# Altium schematic sheet Sheet1.SchDoc
size A4
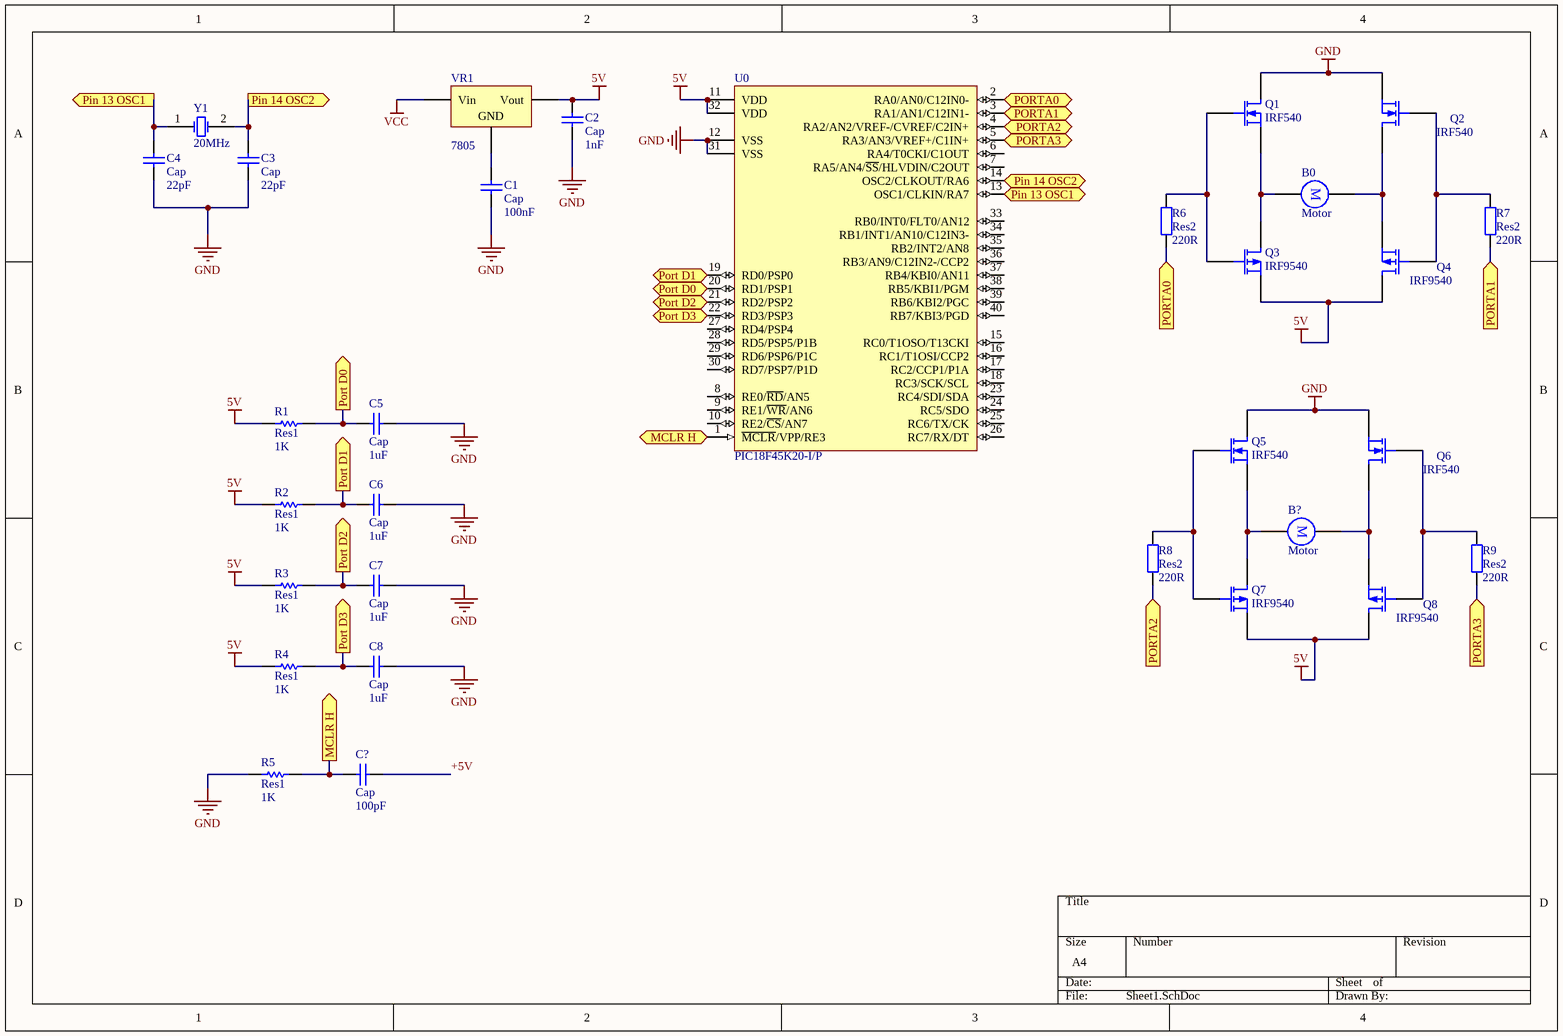
[diagram p0: Sheet1.SchDoc]

## Parts
B0  Motor  [RB5-10.5]
B?  Motor  [RB5-10.5]
C1  Cap  C1: 100nF  [RAD-0.3]
C2  Cap  value 1nF  [RAD-0.3]
C3  Cap  value 22pF  [RAD-0.3]
C4  Cap  value 22pF  [RAD-0.3]
C5  Cap  value 1uF  [RAD-0.3]
C6  Cap  value 1uF  [RAD-0.3]
C7  Cap  value 1uF  [RAD-0.3]
C8  Cap  value 1uF  [RAD-0.3]
C?  Cap  value 100pF  [RAD-0.3]
Q1  IRF540  [BCY-W3/B.8]
Q2  IRF540  [BCY-W3/B.8]
Q3  IRF9540  [BCY-W3/B.8]
Q4  IRF9540  [BCY-W3/B.8]
Q5  IRF540  [BCY-W3/B.8]
Q6  IRF540  [BCY-W3/B.8]
Q7  IRF9540  [BCY-W3/B.8]
Q8  IRF9540  [BCY-W3/B.8]
R1  Res1  value 1K  [AXIAL-0.3]
R2  Res1  value 1K  [AXIAL-0.3]
R3  Res1  value 1K  [AXIAL-0.3]
R4  Res1  value 1K  [AXIAL-0.3]
R5  Res1  value 1K  [AXIAL-0.3]
R6  Res2  value 220R  [AXIAL-0.4]
R7  Res2  value 220R  [AXIAL-0.4]
R8  Res2  value 220R  [AXIAL-0.4]
R9  Res2  value 220R  [AXIAL-0.4]
U0  PIC18F45K20-I/P  [PDIP600-P40]
VR1  7805  [TO254P1510-3_4N]
Y1  20MHz  [BCY-W2/D3.1]

## Ports
MCLR H (out), Pin 13 OSC1 (in), Pin 13 OSC1 (out), Pin 14 OSC2 (in), Pin 14 OSC2 (out), Port D0 (in), Port D0 (out), Port D1 (in), Port D1 (out), Port D2 (in), Port D2 (out), Port D3 (in), Port D3 (out), PORTA0 (in), PORTA0 (out), PORTA1 (in), PORTA1 (out), PORTA2 (in), PORTA2 (out), PORTA3 (in), PORTA3 (out)

## Nets
5V: C2.2 Q3.3(S) Q4.1(D) Q7.3(S) Q8.1(D) R1.1 R2.1 R3.1 R4.1 U0.11(VDD) U0.32(VDD) VR1.3(Vout)
GND: C1.1 C2.1 C3.1 C4.1 C5.2 C6.1 C7.1 C8.1 Q1.1(D) Q2.3(S) Q5.1(D) Q6.3(S) R5.1 U0.12(VSS) U0.31(VSS)
VCC: VR1.1(Vin)
+5V: C?.2
MCLR H: C?.1 R5.2 U0.1(~{MCLR}/VPP/RE3) ; port MCLR H
Pin 13 OSC1: C4.2 U0.13(OSC1/CLKIN/RA7) Y1.1(OSC1) ; port Pin 13 OSC1
Pin 14 OSC2: C3.2 U0.14(OSC2/CLKOUT/RA6) Y1.2(OSC2) ; port Pin 14 OSC2
Port D0: C5.1 R1.2 U0.20(RD1/PSP1) ; port Port D0
Port D1: C6.2 R2.2 U0.19(RD0/PSP0) ; port Port D1
Port D2: C7.2 R3.2 U0.21(RD2/PSP2) ; port Port D2
Port D3: C8.2 R4.2 U0.22(RD3/PSP3) ; port Port D3
PORTA0: R6.1 U0.2(RA0/AN0/C12IN0-) ; port PORTA0
PORTA1: R7.1 U0.3(RA1/AN1/C12IN1-) ; port PORTA1
PORTA2: R8.1 U0.4(RA2/AN2/VREF-/CVREF/C2IN+) ; port PORTA2
PORTA3: R9.1 U0.5(RA3/AN3/VREF+/C1IN+) ; port PORTA3
NetB0_1: B0.1 Q2.1(D) Q4.3(S)
NetB0_2: B0.2 Q1.3(S) Q3.1(D)
NetB?_1: B?.1 Q6.1(D) Q8.3(S)
NetB?_2: B?.2 Q5.3(S) Q7.1(D)
NetC1_2: C1.2 VR1.2(GND)
NetQ1_2: Q1.2(G) Q3.2(G) R6.2
NetQ2_2: Q2.2(G) Q4.2(G) R7.2
NetQ5_2: Q5.2(G) Q7.2(G) R8.2
NetQ6_2: Q6.2(G) Q8.2(G) R9.2

Not connected (* = marked no-connect by the designer): U0 6(RA4/T0CKI/C1OUT) 7(RA5/AN4/~{SS}/HLVDIN/C2OUT) 8(RE0/~{RD}/AN5) 9(RE1/~{WR}/AN6) 10(RE2/~{CS}/AN7) 15(RC0/T1OSO/T13CKI) 16(RC1/T1OSI/CCP2) 17(RC2/CCP1/P1A) 18(RC3/SCK/SCL) 23(RC4/SDI/SDA) 24(RC5/SDO) 25(RC6/TX/CK) 26(RC7/RX/DT) 27(RD4/PSP4) 28(RD5/PSP5/P1B) 29(RD6/PSP6/P1C) 30(RD7/PSP7/P1D) 33(RB0/INT0/FLT0/AN12) 34(RB1/INT1/AN10/C12IN3-) 35(RB2/INT2/AN8) 36(RB3/AN9/C12IN2-/CCP2) 37(RB4/KBI0/AN11) 38(RB5/KBI1/PGM) 39(RB6/KBI2/PGC) 40(RB7/KBI3/PGD)

## Notes on the sheet
- (in symbol Motor) M

## Library data of the parts
B0 B? = Motor: Motor, General Kind; Published: 24-Mar-1999; LatestRevisionDate: 17-Jul-2002; LatestRevisionNote: Re-released for DXP Platform.; PackageReference: RB5-10.5; Publisher: Altium Limited
C1-C8 C? = Cap: Capacitor; Published: 8-Jun-2000; LatestRevisionDate: 17-Jul-2002; LatestRevisionNote: Re-released for DXP Platform.; PackageReference: RAD-0.3; Publisher: Altium Limited
Q1 Q2 Q5 Q6 = MOSFET-N: N-Channel MOSFET; Published: 8-Jun-2000; LatestRevisionDate: 17-Jul-2002; LatestRevisionNote: Re-released for DXP Platform.; PackageVersion: 1995/1996; PackageReference: E3; Publisher: Altium Limited
Q3 Q4 Q7 Q8 = MOSFET-P: P-Channel MOSFET; Published: 8-Jun-2000; LatestRevisionDate: 17-Jul-2002; LatestRevisionNote: Re-released for DXP Platform.; PackageVersion: 1995/1996; PackageReference: E3; Publisher: Altium Limited
R1-R5 = Res1: Resistor; Published: 8-Jun-2000; LatestRevisionDate: 17-Jul-2002; LatestRevisionNote: Re-released for DXP Platform.; PackageReference: AXIAL-0.3; Publisher: Altium Limited
R6-R9 = Res2: Resistor; Published: 8-Jun-2000; LatestRevisionDate: 17-Jul-2002; LatestRevisionNote: Re-released for DXP Platform.; PackageReference: AXIAL-0.4; Publisher: Altium Limited
U0 = PIC18F45K20-I/P: Flash Microcontroller with 10-Bit A/D and nanoWatt Technology, 32K Flash, 40-Pin PDIP, Industrial Temperature Range; FirstPublished: 29-Jan-2009; LatestRevisionDate: 02-Dec-2009; LatestRevisionNote: Updated to datasheet revision F, Sep-2009; DatasheetVersion: revF, Sep-2009; PackageVersion: revBB, Aug-2009; PackageReference: PDIP600-P40; Publisher: Altium Limited; PackageDescription: 40-Lead Plastic Dual In-Line (P) - 600 mil Body [PDIP]; Supplier 1: Digi-Key; Supplier Part Number 1: PIC18F45K20-I/P-ND; Supplier 2: Farnell; Supplier Part Number 2: 1439588; Supplier 3: Newark; Supplier Part Number 3: 88K6041; ComponentLink1Description: Datasheet; ComponentLink1URL: http://ww1.microchip.com/downloads/en/DeviceDoc/41303F.pdf; ComponentLink2Description: Packaging Specification; ComponentLink2URL: http://www.microchip.com/stellent/groups/techpub_sg/documents/packagingspec/en012702.pdf; ComponentLink3Description: Microchip.com Home; ComponentLink3URL: http://www.microchip.com/
VR1 = Volt Reg: Voltage Regulator; Published: 7805; LatestRevisionDate: 29-May-2009; LatestRevisionNote: IPC-7351 Footprint Added.; PackageReference: D2PAK; Publisher: Altium Limited; PackageDescription: 3-Pin Transistor Outline Package 2.54 mm Pitch, 15.1 mm Lead Span
Y1 = XTAL: Crystal Oscillator; Published: 8-Jun-2000; LatestRevisionDate: 17-Jul-2002; LatestRevisionNote: Re-released for DXP Platform.; PackageReference: R38; Publisher: Altium Limited